# Altium schematic sheet RFID.SchDoc
size A
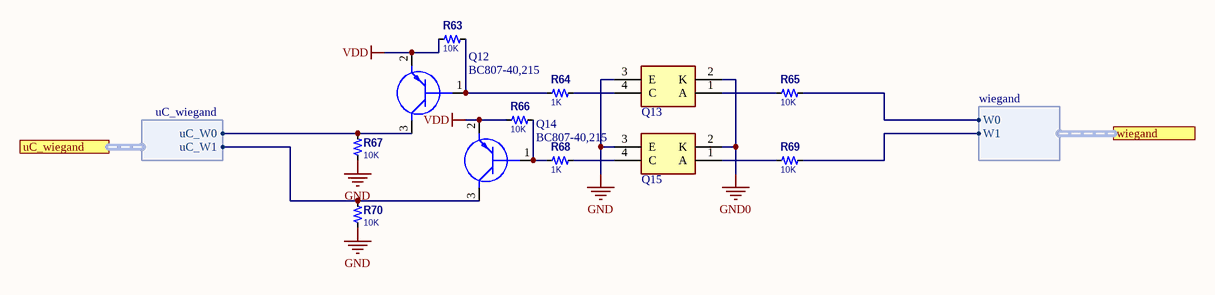
[diagram p0: RFID.SchDoc]

## Parts
Q12  BC807-40,215  [SOT95P230X110-3N]
Q13  TLX9291A_GBTPL,F  [SOIC127P700X230-4N]  (value not drawn)
Q14  BC807-40,215  [SOT95P230X110-3N]
Q15  TLX9291A_GBTPL,F  [SOIC127P700X230-4N]  (value not drawn)
R63  10K  [0603-R]
R64  1K  [0603-R]
R65  10K  [0603-R]
R66  10K  [0603-R]
R67  10K  [0603-R]
R68  1K  [0603-R]
R69  10K  [0603-R]
R70  10K  [0603-R]

## Ports
uC_wiegand (harness uC_wiegand), wiegand (harness wiegand)

## Harnesses
uC_wiegand: uC_W0, uC_W1
wiegand: W0, W1

## Nets
GND: Q13.3(E) Q15.3(E) R67.2 R70.2
GND0: Q13.2(K) Q15.2(K)
VDD: Q12.2(E) Q14.2(E) R63.2 R66.2
NetQ12_1: Q12.1(B) R63.1 R64.2
NetQ12_3: Q12.3(C) R67.1 ; port uC_wiegand.uC_W0
NetQ13_1: Q13.1(A) R65.2
NetQ13_4: Q13.4(C) R64.1
NetQ14_1: Q14.1(B) R66.1 R68.2
NetQ14_3: Q14.3(C) R70.1 ; port uC_wiegand.uC_W1
NetQ15_1: Q15.1(A) R69.2
NetQ15_4: Q15.4(C) R68.1
NetR65_1: R65.1 ; port wiegand.W0
NetR69_1: R69.1 ; port wiegand.W1

## Library data of the parts
Q12 Q14 = BC807-40,215: Transistor BJT PNP; Manufacturer_Name: Nexperia; Datasheet Link: https://assets.nexperia.com/documents/data-sheet/BC807_SER.pdf; Height: 1.1mm; Manufacturer_Part_Number: BC807-40,215; Mouser Part Number: 771-BC807-40-T/R; Mouser Price/Stock: https://www.mouser.co.uk/ProductDetail/Nexperia/BC807-40215?qs=me8TqzrmIYUR795aoYEBCw%3D%3D; Arrow Part Number: BC807-40,215; Arrow Price/Stock: https://www.arrow.com/en/products/bc807-40215/nexperia?region=europe
Q13 Q15 = TLX9291A_GBTPL,F: Phototransistor; Manufacturer_Name: Toshiba; Manufacturer_Part_Number: TLX9291A(GBTPL,F; Datasheet Link: https://toshiba.semicon-storage.com/info/docget.jsp?did=53137&prodName=TLX9291A; Height: 2.3mm; Mouser Part Number: 757-TLX9291AGBTPLF; Mouser Price/Stock: https://www.mouser.co.uk/ProductDetail/Toshiba/TLX9291AGBTPLF?qs=YwPsRIUVAOcOvZScDNZO1w%3D%3D
R63-R70 = Res_2: Manufacturer: Panasonic; Manufacturer Part Number: ERJ-8GEYJ621V; Resistance: 620R; Tolerance: 5%; Voltage Rating: 200V; Temperature Coefficient: 200ppm/°C; Max Power Dissipation: 250mW; ComponentLink1URL: https://datasheet.ciiva.com/15193/getdatasheetpartid-366470-15193725.pdf?src-supplier=Verical; ComponentLink1Description: Datasheet; Supplier 1: Avnet; Stock 1: 6255; Pricing 1: 1 = 0.01200 (USD); RoHS: Yes; Mount: Surface Mount; Case Code (Metric): 3216; Case Code (Imperial): 1206; Contact Plating: Tin; Min Operating Temperature: -55°C; Max Operating Temperature: 155°C; Packaging: Tape and Reel; Package Quantity: 1; Resistor Type: Thick Film; Number of Terminations: 2; Voltage Rating (DC): 200V; Features: Automotive AEC-Q200; Series: ERJ; Construction: Rectangular; Resistance Tolerance: 5%; Length: 3.2mm; Width: 0.063inch; Height: 0.028inch; Depth: 1.6mm; Radiation Hardening: No; REACH SVHC: No SVHC; Military Standard: Not; Lead Free: Lead Free; RoHS Compliant: Yes; ComponentLink2URL: https://datasheet.ciiva.com/46387/1500035-46387094.pdf?src-supplier=Element14; ComponentLink2Description: https://datasheet.ciiva.com/46387/1500035-46387094.pdf?src-supplier=Element14; ComponentLink3URL: https://datasheet.ciiva.com/5915/1500035-5915369.pdf?src-supplier=Farnell; ComponentLink3Description: https://datasheet.ciiva.com/5915/1500035-5915369.pdf?src-supplier=Farnell; ComponentLink4URL: https://datasheet.ciiva.com/28677/1678796-28677018.pdf?src-supplier=Element14; ComponentLink4Description: https://datasheet.ciiva.com/28677/1678796-28677018.pdf?src-supplier=Element14; ComponentLink5URL: https://datasheet.ciiva.com/17204/aoa0000ce1-17204972.pdf?src-supplier=Avnet+Europe; ComponentLink5Description: https://datasheet.ciiva.com/17204/aoa0000ce1-17204972.pdf?src-supplier=Avnet+Europe; ComponentLink6URL: https://datasheet.ciiva.com/16515/aoa0000ce1-16515933.pdf?src-supplier=Avnet+Asia; ComponentLink6Description: https://datasheet.ciiva.com/16515/aoa0000ce1-16515933.pdf?src-supplier=Avnet+Asia; Supplier Part Number 1: 65T8955; Power Rating: 250mW; Case/Package: 0603